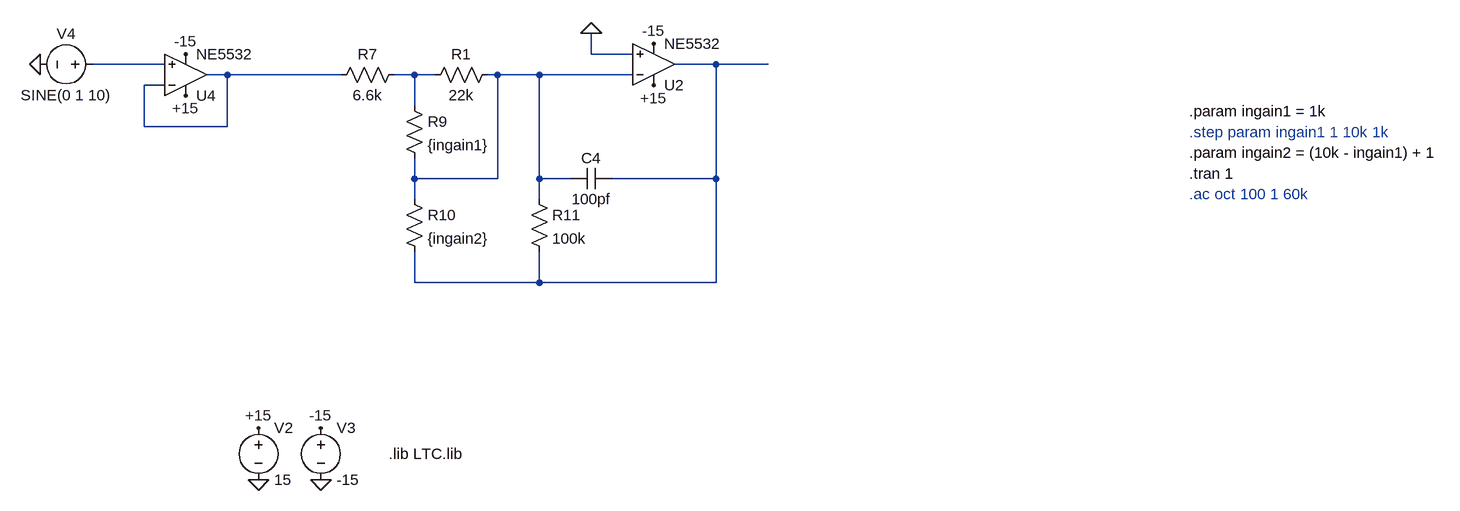
[diagram p0: schematic Active Gain .asc]
Active Gain .asc, the LTspice schematic file:
Version 4
SHEET 1 2032 1456
WIRE 720 400 720 368
WIRE 784 400 720 400
WIRE 64 416 -48 416
WIRE 912 416 848 416
WIRE 992 416 912 416
WIRE 160 432 128 432
WIRE 336 432 160 432
WIRE 448 432 416 432
WIRE 480 432 448 432
WIRE 576 432 560 432
WIRE 640 432 576 432
WIRE 784 432 640 432
WIRE 64 448 32 448
WIRE 448 480 448 432
WIRE 32 512 32 448
WIRE 160 512 160 432
WIRE 160 512 32 512
WIRE 448 592 448 560
WIRE 576 592 576 432
WIRE 576 592 448 592
WIRE 640 592 640 432
WIRE 688 592 640 592
WIRE 912 592 912 416
WIRE 912 592 752 592
WIRE 448 624 448 592
WIRE 640 624 640 592
WIRE 448 752 448 704
WIRE 640 752 640 704
WIRE 640 752 448 752
WIRE 912 752 912 592
WIRE 912 752 640 752
FLAG 208 1056 0
FLAG 208 976 +15
FLAG 304 1056 0
FLAG 304 976 -15
FLAG -128 416 0
FLAG 720 368 0
FLAG 816 384 -15
FLAG 816 448 +15
FLAG 96 464 +15
FLAG 96 400 -15
SYMBOL voltage 208 960 R0
SYMATTR InstName V2
SYMATTR Value 15
SYMBOL voltage 304 960 R0
SYMATTR InstName V3
SYMATTR Value -15
SYMBOL OpAmps/opamp2 816 480 M180
SYMATTR InstName U2
SYMATTR Value NE5532
SYMBOL voltage -32 416 R90
WINDOW 0 -32 56 VBottom 2
WINDOW 3 32 56 VTop 2
SYMATTR InstName V4
SYMATTR Value SINE(0 1 10)
SYMATTR Value2 AC 1
SYMBOL res 432 416 R90
WINDOW 0 0 56 VBottom 2
WINDOW 3 32 56 VTop 2
SYMATTR InstName R7
SYMATTR Value 6.6k
SYMBOL res 432 464 R0
SYMATTR InstName R9
SYMATTR Value {ingain1}
SYMBOL res 432 608 R0
SYMATTR InstName R10
SYMATTR Value {ingain2}
SYMBOL res 624 608 R0
SYMATTR InstName R11
SYMATTR Value 100k
SYMBOL cap 752 576 R90
WINDOW 0 0 32 VBottom 2
WINDOW 3 32 32 VTop 2
SYMATTR InstName C4
SYMATTR Value 100pf
SYMBOL OpAmps/opamp2 96 496 M180
SYMATTR InstName U4
SYMATTR Value NE5532
SYMBOL res 576 416 R90
WINDOW 0 0 56 VBottom 2
WINDOW 3 32 56 VTop 2
SYMATTR InstName R1
SYMATTR Value 22k
TEXT 408 1016 Left 2 !.lib LTC.lib
TEXT 1640 616 Left 2 ;.ac oct 100 1 60k
TEXT 1640 488 Left 2 !.param ingain1 = 1k
TEXT 1640 552 Left 2 !.param ingain2 = (10k - ingain1) + 1
TEXT 1640 584 Left 2 !.tran 1
TEXT 1640 520 Left 2 ;.step param ingain1 1 10k 1k

The netlist it stands for:
* Active Gain .asc
V2 +15 0 15
V3 -15 0 -15
XU2 0 N005 +15 -15 N002 NE5532  ; pins In+ In- V+ V- OUT
V4 N001 0 SINE(0 1 10) AC 1
R7 N004 N003 6.6k
R9 N004 N005 {ingain1}
R10 N005 N002 {ingain2}
R11 N005 N002 100k
C4 N002 N005 100pf
XU4 N001 N003 +15 -15 N003 NE5532  ; pins In+ In- V+ V- OUT
R1 N005 N004 22k
.lib LTC.lib
* .ac oct 100 1 60k
.param ingain1 = 1k
.param ingain2 = (10k - ingain1) + 1
.tran 1
* .step param ingain1 1 10k 1k
.backanno
.end